# Altium schematic sheet [01] COVER PAGE.SchDoc: UWBNode
size A4; Author: Hom; CompanyName: KitSprout; DrawnBy: Hom; Engineer: Hom; Organization: KitSprout; Revision: B; SheetNumber: 1; SheetTotal: 6; Version: v1.6D; LibVersion: v3.2
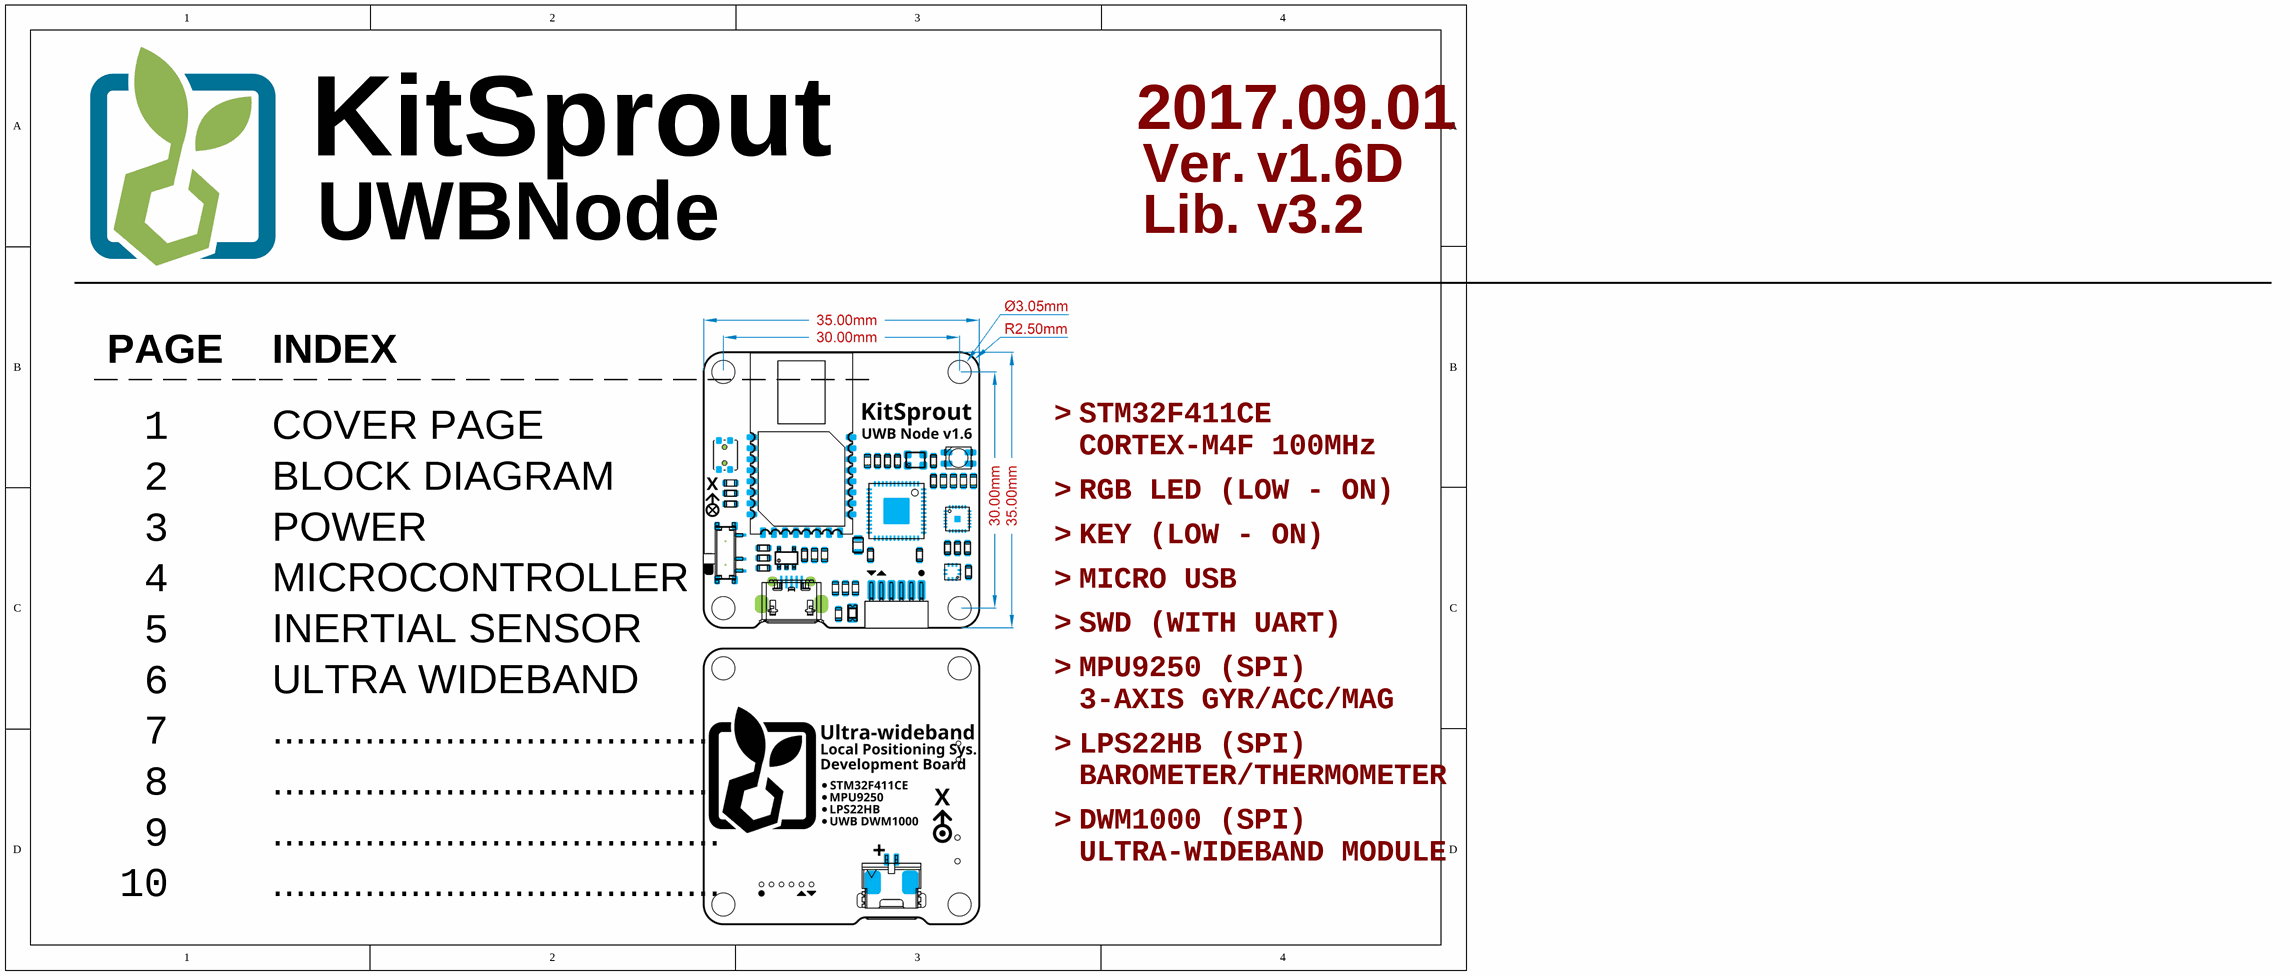
[diagram p0: [01] COVER PAGE.SchDoc]

## Notes on the sheet
- 2017.09.01
- Ver.
- ________________________________________________________________________
- Lib.
- _ _ _ _ _
- PAGE
- _ _ _ _ _ _ _ _ _ _ _ _ _ _ _ _ _ _
- INDEX
- 1
- COVER PAGE
- >
- STM32F411CE
- CORTEX-M4F 100MHz
- 2
- 3
- BLOCK DIAGRAM
- POWER
- RGB LED (LOW - ON)
- KEY (LOW - ON)
- 4
- MICROCONTROLLER
- MICRO USB
- 5
- INERTIAL SENSOR
- SWD (WITH UART)
- 6
- ULTRA WIDEBAND
- MPU9250 (SPI)
- 3-AXIS GYR/ACC/MAG
- 7
- 8
- .......................................
- LPS22HB (SPI)
- BAROMETER/THERMOMETER
- 9
- DWM1000 (SPI)
- ULTRA-WIDEBAND MODULE
- 10